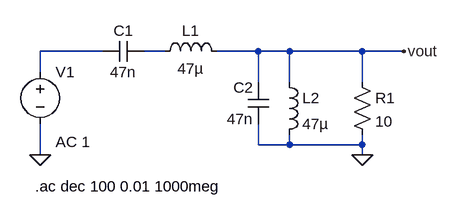
[diagram p0: schematic LC_Band_Pass_Filter.asc]
LC_Band_Pass_Filter.asc, the LTspice schematic file:
Version 4
SHEET 1 880 680
WIRE 80 48 -16 48
WIRE 176 48 144 48
WIRE 320 48 256 48
WIRE 368 48 320 48
WIRE 480 48 368 48
WIRE 544 48 480 48
WIRE -16 80 -16 48
WIRE 320 96 320 48
WIRE 368 96 368 48
WIRE 480 96 480 48
WIRE 320 192 320 160
WIRE 368 192 368 176
WIRE 368 192 320 192
WIRE 480 192 480 176
WIRE 480 192 368 192
WIRE -16 208 -16 160
WIRE 480 208 480 192
FLAG -16 208 0
FLAG 480 208 0
FLAG 544 48 vout
SYMBOL voltage -16 64 R0
WINDOW 123 24 124 Left 2
WINDOW 39 0 0 Left 0
SYMATTR Value2 AC 1
SYMATTR InstName V1
SYMATTR Value ""
SYMBOL cap 144 32 R90
WINDOW 0 0 32 VBottom 2
WINDOW 3 32 32 VTop 2
SYMATTR InstName C1
SYMATTR Value 47n
SYMBOL cap 336 160 R180
WINDOW 0 24 56 Left 2
WINDOW 3 24 8 Left 2
SYMATTR InstName C2
SYMATTR Value 47n
SYMBOL ind 160 64 R270
WINDOW 0 32 56 VTop 2
WINDOW 3 5 56 VBottom 2
SYMATTR InstName L1
SYMATTR Value 47µ
SYMBOL ind 352 80 R0
SYMATTR InstName L2
SYMATTR Value 47µ
SYMBOL res 464 80 R0
SYMATTR InstName R1
SYMATTR Value 10
TEXT -24 256 Left 2 !.ac dec 100 0.01 1000meg

The netlist it stands for:
* LC_Band_Pass_Filter.asc
V1 N001 0 AC 1
C1 N002 N001 47n
C2 0 vout 47n
L1 N002 vout 47µ
L2 vout 0 47µ
R1 vout 0 10
.ac dec 100 0.01 1000meg
.backanno
.end